# EAGLE design Sensor (EAGLE 9.3.0)
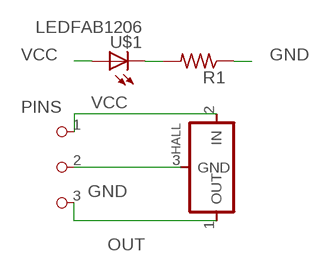
[diagram p0: schematic, sheet 1]

## Parts
HALL  REGULATORSOT23  [SOT23]
PINS  SPDTSWITCH  [SPDTSWITCH]
R1  RES-US1206FAB  [R1206FAB]
U$1  LEDFAB1206  [LED1206FAB]

## Nets
GND: HALL.3(GND) PINS.2 R1.1
N$1: R1.2 U$1.2(C)
OUT: HALL.1(OUT) PINS.3
VCC: HALL.2(IN) PINS.1 U$1.1(A)

## Library data of the parts
HALL = fab:REGULATOR
PINS = fab:SPDTSWITCH
R1 = fab:RES-US: Resistor (US Symbol) Variants with postfix FAB are widened to allow the routing of internal traces
U$1 = fab:LED: LED

## Board
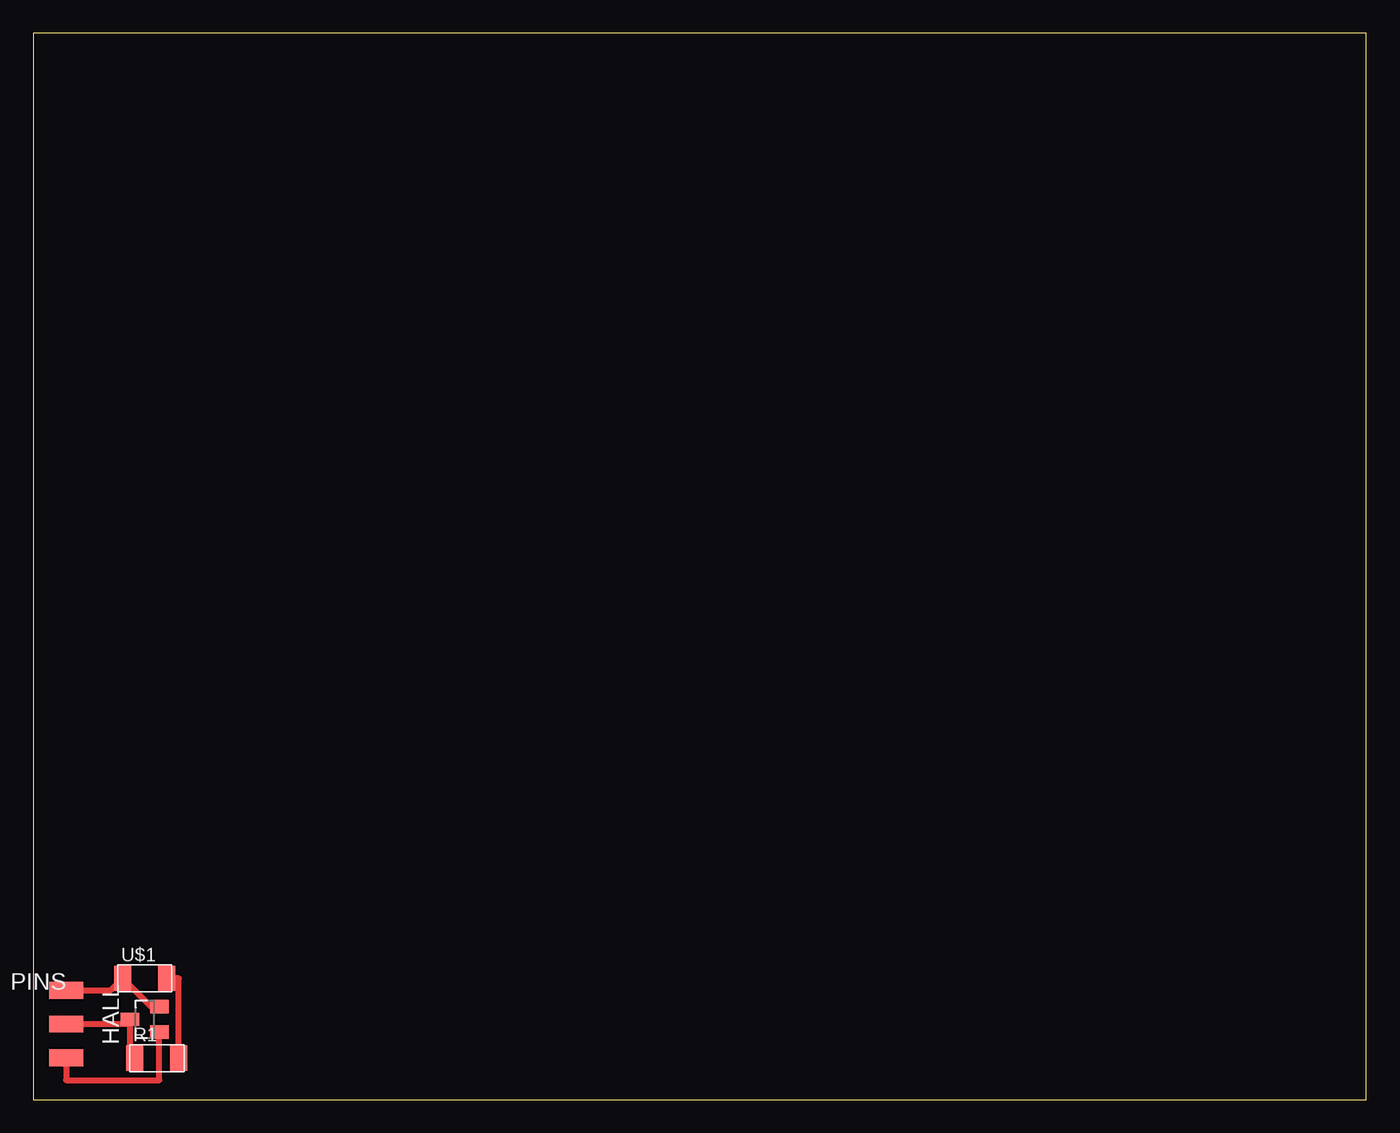
[diagram p1: board, top side]

Size 100 x 80 mm. Coordinates in mm from the lower left corner, seen from the top.
Outline: 0,0 100,0 100,80 0,80 0,0
Copper layers (1*16): Top 0.035mm / dielectric 1.5mm / Bottom 0.035mm
Design rules "default *": minimum track width 0.45mm, minimum drill 0.03125mm, track to track 0.45mm, track to pad 0.45mm, pad to pad 0.45mm, via to via 0.45mm, smd to smd 0.45mm, copper to edge 40mil, drill to drill 6mil, minimum pad ring 10mil, minimum via ring 8mil, stop-mask expansion 4mil, vias tented up to drill 0mil, thermal gap 10mil

### Footprints (pad centres in the part's own frame; a part is rotated, then mirrored left to right if it is on the bottom)
SOT23 = smd 1 x 1.4: 1 -0.95,-1.1; 2 0.95,-1.1; 3 0,1.1
SPDTSWITCH = smd 2.54 x 1.27: 1 0.38,2.54; 2 0.38,0; 3 0.38,-2.54
R1206FAB = smd 1.27 x 1.905: 1 -1.651,0; 2 1.651,0
LED1206FAB = smd 1.27 x 1.905: 1 -1.651,0; 2 1.651,0

### Placement (x,y rotation side)
HALL  8.36,6.02 90 top
PINS  2.08,5.66 0 top
R1  9.27,3.1 0 top
U$1  8.36,9.09 0 top

### Tracks (layer width: path | path; a pad name or v marks a point on that pad's centre or on a via)
GND
  Top 0.45: PINS.2 7.26,5.66 HALL.3 7.26,3.1 R1.1
N$1
  Top 0.45: R1.2 10.92,9.09 U$1.2
OUT
  Top 0.45: HALL.1 9.46,1.45 2.46,1.45 PINS.3
VCC
  Top 0.45: HALL.2 8.83,6.97 U$1.1 5.82,8.2 PINS.1